# Altium schematic sheet motor_42.SchDoc: 使用CH32V307自制核心板(删库跑路队)
size A3; Author: rofirger
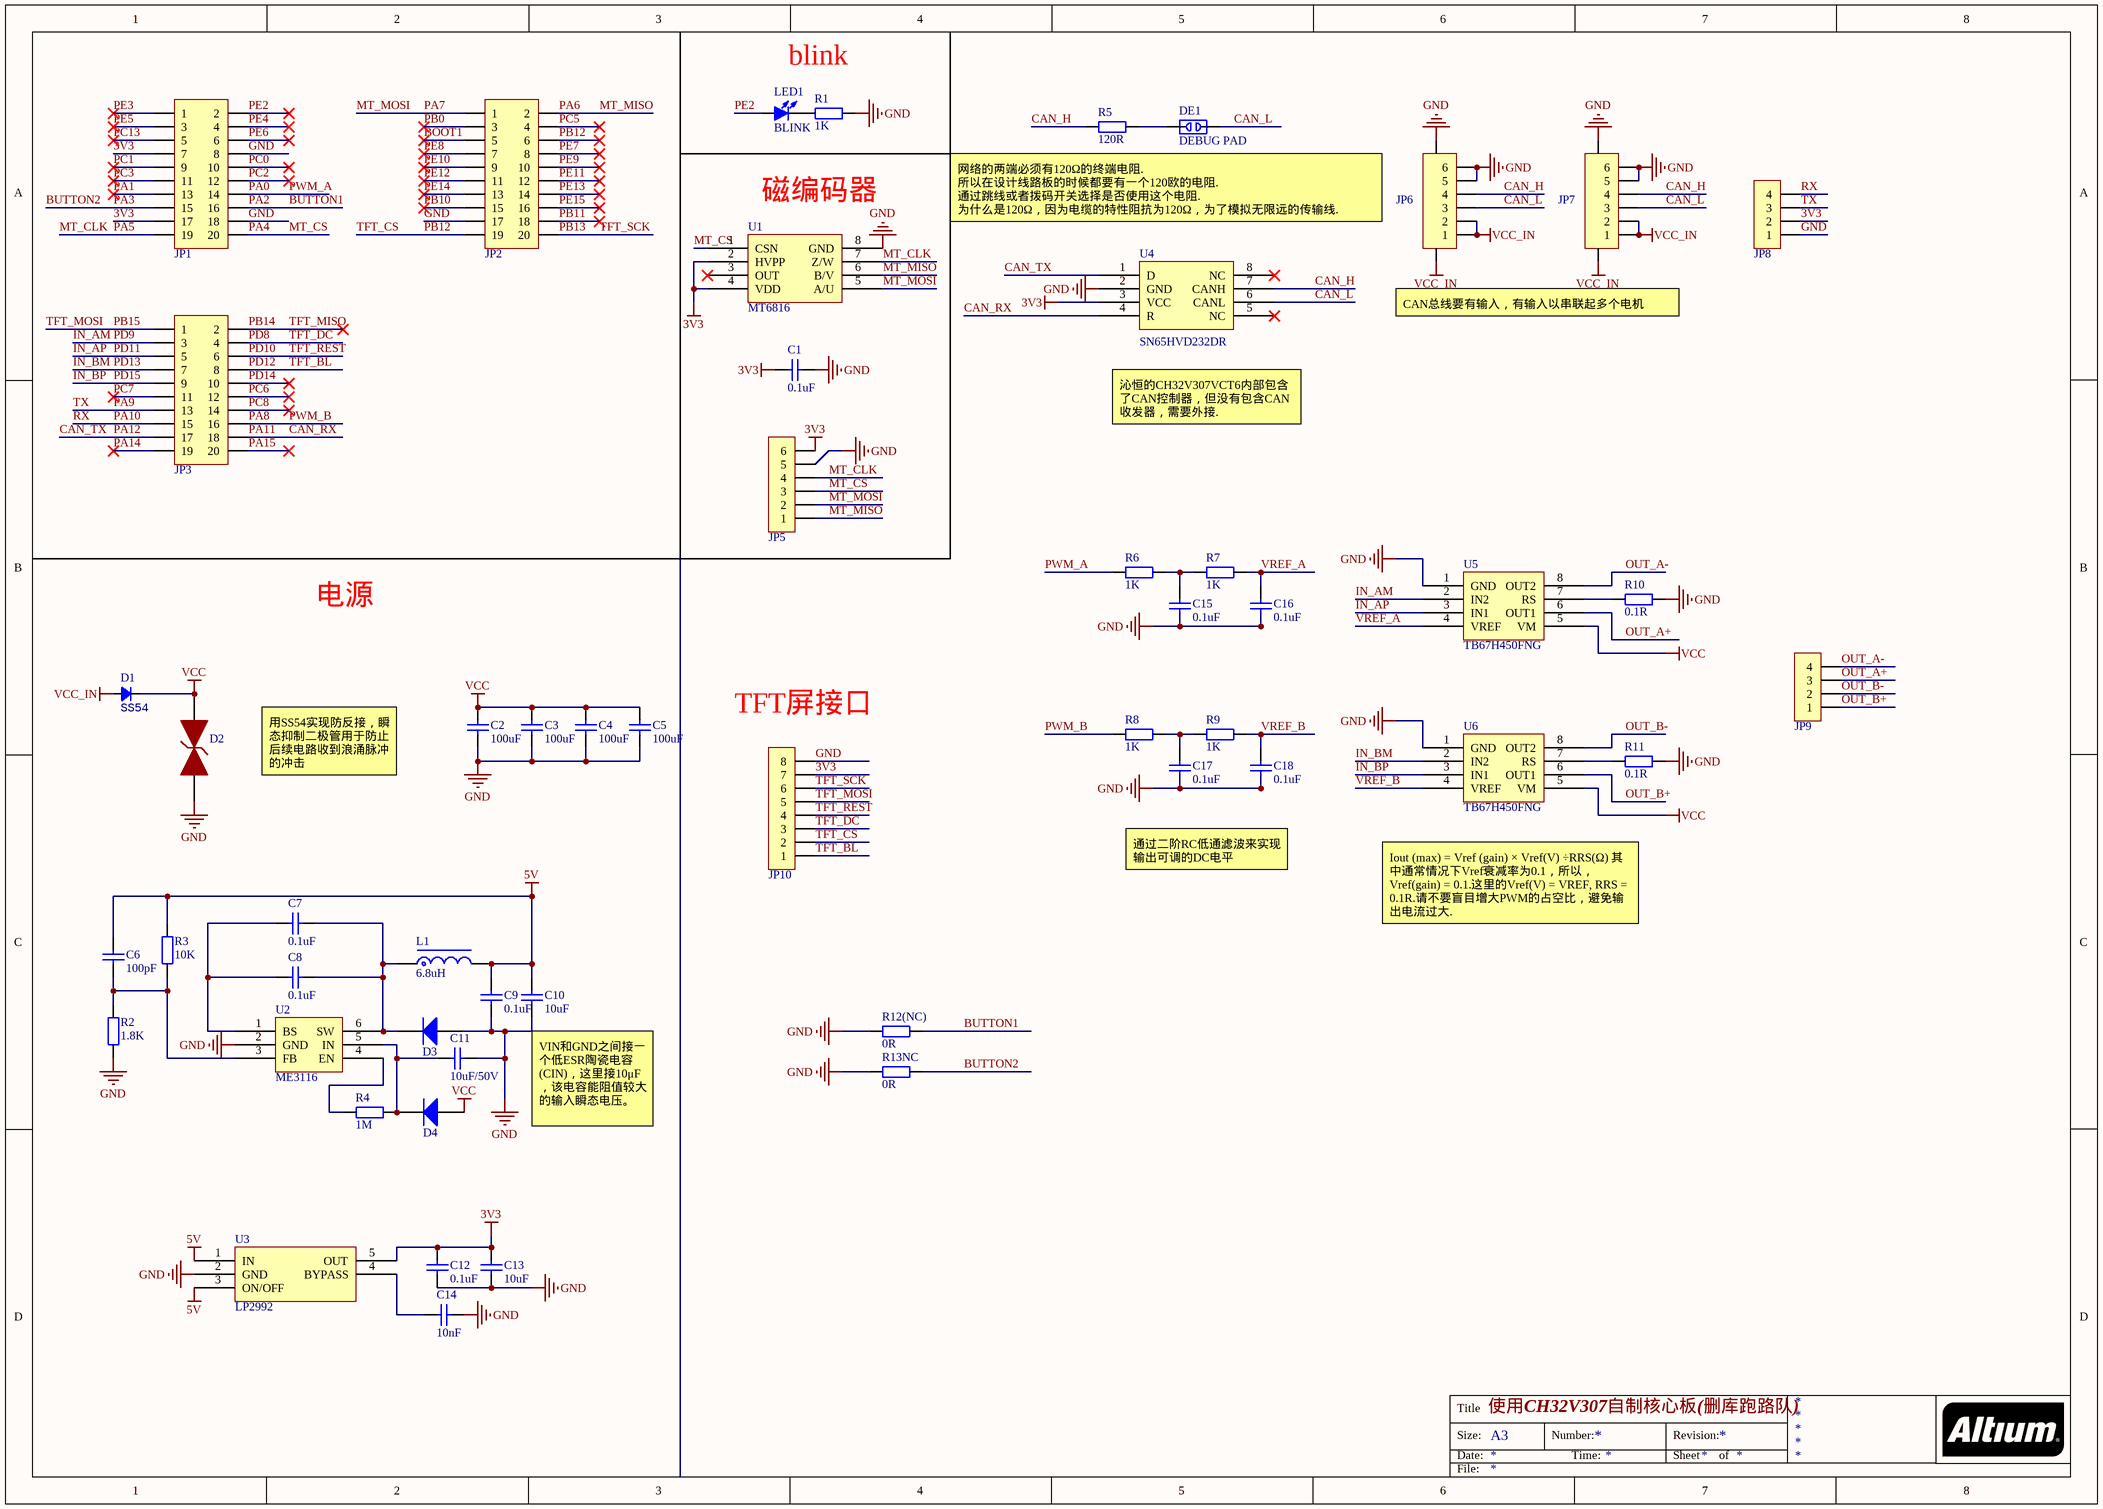
[diagram p0: motor_42.SchDoc]

## Parts
C1  0.1uF  [C0805_L]
C2  100uF  [C1206_L]
C3  100uF  [C1206_L]
C4  100uF  [C1206_L]
C5  100uF  [C1206_L]
C6  100pF  [C0402_L]
C7  0.1uF  [C0402_L]
C8  0.1uF  [C0402_L]
C9  0.1uF  [C0402_L]
C10  10uF  [C0402_L]
C11  10uF/50V  [C0603_L]
C12  0.1uF  [C0402_L]
C13  10uF  [C0402_L]
C14  10nF  [C0402_L]
C15  0.1uF  [C0402_L]
C16  0.1uF  [C0402_L]
C17  0.1uF  [C0402_L]
C18  0.1uF  [C0402_L]
D1  SS54  [SMA]
D2  SMBJ28CA  [SMB]  (value not drawn)
D3  二极管-5819W  [SOD-323]  (value not drawn)
D4  二极管-5819W  [SOD-323]  (value not drawn)
DE1  DEBUG PAD  [DEBUG_A]
JP1  Header 2X10  [HDR2.54-LI-2x10P]  (value not drawn)
JP2  Header 2X10  [HDR2.54-LI-2x10P]  (value not drawn)
JP3  Header 2X10  [HDR2.54-LI-2x10P]  (value not drawn)
JP5  HDR-1X6  [HDR2.54-LI-6P]  (value not drawn)
JP6  HDR-1X6  [SH1.0-WT-6P]  (value not drawn)
JP7  HDR-1X6  [SH1.0-WT-6P]  (value not drawn)
JP8  HDR-1X4  [HDR2.54-LI-4P]  (value not drawn)
JP9  HDR-1X4  [XH2.54-LI-4P]  (value not drawn)
JP10  HDR-1X8  [HDR2.54-M-LI-8P]  (value not drawn)
L1  6.8uH  [L-SMD-0420]
LED1  BLINK  [LED0805_G]
R1  1K  [R0402_L]
R2  1.8K  [R0402_L]
R3  10K  [R0402_L]
R4  1M  [R0402_L]
R5  120R  [R0402_L]
R6  1K  [R0402_L]
R7  1K  [R0402_L]
R8  1K  [R0402_L]
R9  1K  [R0402_L]
R10  0.1R  [R1206_L]
R11  0.1R  [R1206_L]
R12(NC)  0R  [R0603_L]
R13NC  0R  [R0603_L]
U1  MT6816  [SOP8_L]
U2  ME3116  [SOT23-6]
U3  LP2992  [SOT23-5]
U4  Manufacturer Part Number: SN65HVD232DR  [SOIC-8]  (hidden comment: SN65HVD232D)
U5  TB67H450FNG  [HSOP-8]
U6  TB67H450FNG  [HSOP-8]

## Nets
3V3: C1.1 C12.2 C13.2 JP1.7 JP1.17 JP5.6 JP8.2 JP10.7 U1.2(HVPP) U1.4(VDD) U3.5(OUT) U4.3(VCC)
5V: C6.2 C9.1 C10.2 L1.2 R3.2 U3.1(IN) U3.3(ON/OFF)
GND: C1.2 C2.1 C3.1 C4.1 C5.1 C9.2 C10.1 C11.1 C12.1 C13.1 C14.1 C15.1 C16.1 C17.1 C18.1 D2.1 D3.1(A) JP1.8 JP1.18 JP2.17 JP5.5 JP6.0 JP6.5 JP6.6 JP7.0 JP7.5 JP7.6 JP8.1 JP10.8 R1.2 R2.1 R10.2 R11.2 R12(NC).1 R13NC.1 U1.8(GND) U2.2(GND) U3.2(GND) U4.2(GND) U5.1(GND) U6.1(GND)
VCC: C2.2 C3.2 C4.2 C5.2 D1.2(K) D2.2 D4.1(A) U5.5(VM) U6.5(VM)
VCC_IN: D1.1(A) JP6.0 JP6.1 JP6.2 JP7.0 JP7.1 JP7.2
BOOT1: JP2.5
BUTTON1: JP1.16 R12(NC).2  [also labelled PA2]
BUTTON2: JP1.15 R13NC.2  [also labelled PA3]
CAN_H: JP6.4 JP7.4 R5.1 U4.7(CANH)
CAN_L: DE1.2 JP6.3 JP7.3 U4.6(CANL)
CAN_RX: JP3.18 U4.4(R)  [also labelled PA11]
CAN_TX: JP3.17 U4.1(D)  [also labelled PA12]
IN_AM: JP3.3 U5.2(IN2)  [also labelled PD9]
IN_AP: JP3.5 U5.3(IN1)  [also labelled PD11]
IN_BM: JP3.7 U6.2(IN2)  [also labelled PD13]
IN_BP: JP3.9 U6.3(IN1)  [also labelled PD15]
MT_CLK: JP1.19 JP5.4 U1.7(Z/W)  [also labelled PA5]
MT_CS: JP1.20 JP5.3 U1.1(CSN)  [also labelled PA4]
MT_MISO: JP2.2 JP5.1 U1.6(B/V)  [also labelled PA6]
MT_MOSI: JP2.1 JP5.2 U1.5(A/U)  [also labelled PA7]
OUT_A+: JP9.3 U5.6(OUT1)
OUT_A-: JP9.4 U5.8(OUT2)
OUT_B+: JP9.1 U6.6(OUT1)
OUT_B-: JP9.2 U6.8(OUT2)
PA0: JP1.14 R6.1  [also labelled PWM_A]
PA1: JP1.13
PA8: JP3.16 R8.1  [also labelled PWM_B]
PA9: JP3.13 JP8.3  [also labelled TX]
PA10: JP3.15 JP8.4  [also labelled RX]
PA14: JP3.19
PA15: JP3.20
PB0: JP2.3
PB10: JP2.15
PB11: JP2.18
PB12: JP2.6 JP2.19 JP10.2  [also labelled TFT_CS]
PB13: JP2.20 JP10.6  [also labelled TFT_SCK]
PB14: JP3.2  [also labelled TFT_MISO]
PB15: JP3.1 JP10.5  [also labelled TFT_MOSI]
PC0: JP1.10
PC1: JP1.9
PC2: JP1.12
PC3: JP1.11
PC5: JP2.4
PC6: JP3.12
PC7: JP3.11
PC8: JP3.14
PC13: JP1.5
PD8: JP3.4 JP10.3  [also labelled TFT_DC]
PD10: JP3.6 JP10.4  [also labelled TFT_REST]
PD12: JP3.8 JP10.1  [also labelled TFT_BL]
PD14: JP3.10
PE2: JP1.2 LED1.1(A)
PE3: JP1.1
PE4: JP1.4
PE5: JP1.3
PE6: JP1.6
PE7: JP2.8
PE8: JP2.7
PE9: JP2.10
PE10: JP2.9
PE11: JP2.12
PE12: JP2.11
PE13: JP2.14
PE14: JP2.13
PE15: JP2.16
VREF_A: C16.2 R7.2 U5.4(VREF)
VREF_B: C18.2 R9.2 U6.4(VREF)
NetC6_1: C6.1 R2.2 R3.1 U2.3(FB)
NetC7_1: C7.1 C8.1 D3.2(K) L1.1 U2.6(SW)
NetC7_2: C7.2 C8.2 U2.1(BS)
NetC11_2: C11.2 D4.2(K) R4.2 U2.5(IN)
NetC14_2: C14.2 U3.4(BYPASS)
NetC15_2: C15.2 R6.2 R7.1
NetC17_2: C17.2 R8.2 R9.1
NetDE1_1: DE1.1 R5.2
NetLED1_2: LED1.2(K) R1.1
NetR4_1: R4.1 U2.4(EN)
NetR10_1: R10.1 U5.7(RS)
NetR11_1: R11.1 U6.7(RS)

Not connected (* = marked no-connect by the designer): U1 3(OUT)*; U4 5(NC)* 8(NC)*

## Notes on the sheet
- blink
- 磁编码器
- 网络的两端必须有120Ω的终端电阻.
  所以在设计线路板的时候都要有一个120欧的电阻.
  通过跳线或者拨码开关选择是否使用这个电阻.
  为什么是120Ω，因为电缆的特性阻抗为120Ω，为了模拟无限远的传输线.
- CAN总线要有输入，有输入以串联起多个电机
- 沁恒的CH32V307VCT6内部包含了CAN控制器，但没有包含CAN收发器，需要外接.
- 电源
- (near JP10) TFT屏接口
- 用SS54实现防反接，瞬态抑制二极管用于防止后续电路收到浪涌脉冲的冲击
- 通过二阶RC低通滤波来实现输出可调的DC电平
- Iout (max) = Vref (gain) × Vref(V) ÷RRS(Ω) 其中通常情况下Vref衰减率为0.1，所以，Vref(gain) = 0.1.这里的Vref(V) = VREF, RRS = 0.1R.请不要盲目增大PWM的占空比，避免输出电流过大.
- (near C10) VIN和GND之间接一个低ESR陶瓷电容(CIN)，这里接10μF，该电容能阻值较大的输入瞬态电压。
- Title
- Size:
- Date:
- A3
- Number:
- Time:
- Revision:
- Sheet
- of
- File:

## Library data of the parts
C1-C10 C12-C18 = C: 贴片电容/MLCC电容; BOM名称: 无极性贴片电容; 联系卖家，免费查找封装: 唯一出售店铺网址https://shop463601444.taobao.com
C11 = C: 陶瓷电容; BOM名称: 无极性贴片电容; 联系卖家，免费查找封装: 唯一出售店铺网址https://shop463601444.taobao.com
D1 = Diode_SMA: Diode; Value: SS54; Type: SMA
D3 D4 = 二极管-5819W: 40V
DE1 = DEBUG: 调试断点焊盘; 联系卖家，免费查找封装: 唯一出售店铺网址https://shop463601444.taobao.com; 封装库来自淘宝卖家ID：黄晶宝石: 其他店铺购入的，请立即申请退款，本店现金奖励20~500元; BOM名称: 调试断点焊盘
JP1-JP3 = Header 10X2: 10*2P接插件; 联系卖家，免费查找封装: 唯一出售店铺网址https://shop463601444.taobao.com; 封装库来自淘宝卖家ID:黄晶宝石: 其他店铺购入均为盗版假冒封装库，请立即申请退款，本店现金奖励20~200元; BOM名称: 10*2P接插件
JP5 = Header 6: 6P接插件; 联系卖家，免费查找封装: 唯一出售店铺网址https://shop463601444.taobao.com; 封装库来自淘宝卖家ID:黄晶宝石: 其他店铺购入均为盗版假冒封装库，请立即申请退款，本店现金奖励20~200元; BOM名称: 6P接插件
JP6 JP7 = Header 6: 6P连接器; 联系卖家 免费查找封装: 唯一出售店铺网址https://shop463601444.taobao.com; 联系卖家 免费技术支持: 封装库来自淘宝卖家ID：黄晶宝石; BOM名称: 6P连接器
JP8 JP9 = Header 4: 4P接插件; 联系卖家，免费查找封装: 唯一出售店铺网址https://shop463601444.taobao.com; 封装库来自淘宝卖家ID:黄晶宝石: 其他店铺购入均为盗版假冒封装库，请立即申请退款，本店现金奖励20~200元; BOM名称: 4P接插件
JP10 = Header 8: 8P接插件; 联系卖家，免费查找封装: 唯一出售店铺网址https://shop463601444.taobao.com; 封装库来自淘宝卖家ID:黄晶宝石: 其他店铺购入均为盗版假冒封装库，请立即申请退款，本店现金奖励20~200元; BOM名称: 8P接插件
L1 = L-Molding Choke: 一体成型电感; 联系卖家，免费查找封装: 唯一出售店铺网址https://shop463601444.taobao.com; BOM名称: 一体成型电感
LED1 = LED-SMD: 贴片LED; 封装库来自淘宝卖家ID：黄晶宝石: 其他店铺购入均为盗版封装库，请立即申请退款，本店现金奖励20~200元; BOM名称: 贴片LED
R1-R11 R12(NC) R13NC = R: 贴片电阻; 联系卖家，免费查找封装: 唯一出售店铺网址https://shop463601444.taobao.com; BOM名称: 贴片电阻
U4 = SN65HVD232D: Manufacturer: Texas Instruments; Protocol: CAN; Number of Drivers/Receivers: 1/1; Duplex: Half; Data Rate: 1Mbps; Voltage - Supply: 3 V ~ 3.6 V; Supplier 1: Digi-Key; Supplier Part Number 1: 296-26344-2-ND; RoHS: RoHS Compliant; Category: Integrated Circuits (ICs); Stock: 5000; Pricing 1: 2500=0.84375 (USD); Packaging: Tape & Reel (TR); Part Status: Active; Type: Transceiver; Operating Temperature: -40°C ~ 85°C; Mounting Type: Surface Mount; Package / Case: 8-SOIC (0.154", 3.90mm Width); Supplier Device Package: 8-SOIC; ComponentLink1URL: http://www.ti.com/lit/ds/symlink/sn65hvd230.pdf; ComponentLink1Description: http://www.ti.com/lit/ds/symlink/sn65hvd230.pdf; Supplier 2: Digi-Key; Supplier Part Number 2: 296-26344-1-ND; Pricing 2: 1=2.05, 10=1.842, 100=1.4809, 500=1.21668, 1000=1.00811 (USD)